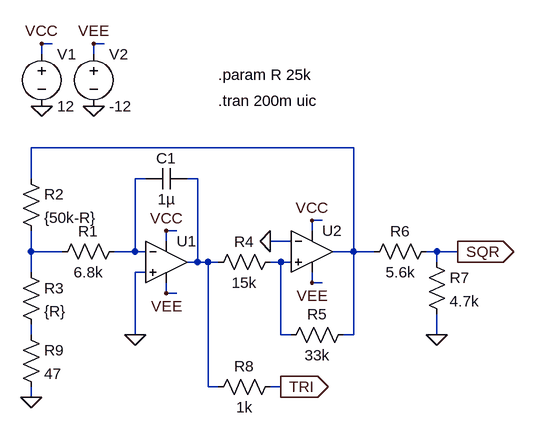
[diagram p0: schematic SimpleLFO.asc]
SimpleLFO.asc, the LTspice schematic file:
Version 4
SHEET 1 880 680
WIRE -48 -176 -64 -176
WIRE 32 -176 16 -176
WIRE -64 -160 -64 -176
WIRE 16 -160 16 -176
WIRE 416 -16 -80 -16
WIRE -80 32 -80 -16
WIRE 96 32 80 32
WIRE 176 32 160 32
WIRE 368 96 352 96
WIRE 144 112 128 112
WIRE 352 112 352 96
WIRE 128 128 128 112
WIRE 320 128 288 128
WIRE -80 144 -80 112
WIRE -32 144 -80 144
WIRE 80 144 80 32
WIRE 80 144 48 144
WIRE 96 144 80 144
WIRE 416 144 416 -16
WIRE 416 144 384 144
WIRE 448 144 416 144
WIRE 544 144 528 144
WIRE 576 144 544 144
WIRE 176 160 176 32
WIRE 176 160 160 160
WIRE 192 160 176 160
WIRE 208 160 192 160
WIRE 304 160 288 160
WIRE 320 160 304 160
WIRE 544 160 544 144
WIRE -80 176 -80 144
WIRE 96 176 80 176
WIRE 352 192 352 176
WIRE 368 192 352 192
WIRE 128 208 128 192
WIRE 144 208 128 208
WIRE -80 272 -80 256
WIRE 80 272 80 176
WIRE 304 272 304 160
WIRE 320 272 304 272
WIRE 416 272 416 144
WIRE 416 272 400 272
WIRE 544 272 544 240
WIRE 192 352 192 160
WIRE 208 352 192 352
WIRE 304 352 288 352
WIRE -80 368 -80 352
FLAG 128 112 VCC
FLAG 128 208 VEE
FLAG 352 96 VCC
FLAG 352 192 VEE
FLAG 288 128 0
FLAG 80 272 0
FLAG 544 272 0
FLAG 304 352 TRI
IOPIN 304 352 Out
FLAG 576 144 SQR
IOPIN 576 144 Out
FLAG -80 368 0
FLAG -64 -80 0
FLAG 16 -80 0
FLAG -64 -176 VCC
FLAG 16 -176 VEE
SYMBOL Opamps\\UniversalOpamp2 128 160 R0
SYMATTR InstName U1
SYMBOL Opamps\\UniversalOpamp2 352 144 R0
SYMATTR InstName U2
SYMBOL cap 160 16 R90
WINDOW 0 0 32 VBottom 2
WINDOW 3 32 32 VTop 2
SYMATTR InstName C1
SYMATTR Value 1µ
SYMBOL res 64 128 R90
WINDOW 0 0 56 VBottom 2
WINDOW 3 32 56 VTop 2
SYMATTR InstName R1
SYMATTR Value 6.8k
SYMBOL res -96 16 R0
SYMATTR InstName R2
SYMATTR Value {50k-R}
SYMBOL res -96 160 R0
SYMATTR InstName R3
SYMATTR Value {R}
SYMBOL res 304 144 R90
WINDOW 0 0 56 VBottom 2
WINDOW 3 32 56 VTop 2
SYMATTR InstName R4
SYMATTR Value 15k
SYMBOL res 416 256 R90
WINDOW 0 0 56 VBottom 2
WINDOW 3 32 56 VTop 2
SYMATTR InstName R5
SYMATTR Value 33k
SYMBOL res 544 128 R90
WINDOW 0 0 56 VBottom 2
WINDOW 3 32 56 VTop 2
SYMATTR InstName R6
SYMATTR Value 5.6k
SYMBOL res 528 144 R0
SYMATTR InstName R7
SYMATTR Value 4.7k
SYMBOL res 304 336 R90
WINDOW 0 0 56 VBottom 2
WINDOW 3 32 56 VTop 2
SYMATTR InstName R8
SYMATTR Value 1k
SYMBOL voltage -64 -176 R0
WINDOW 123 0 0 Left 0
WINDOW 39 0 0 Left 0
SYMATTR InstName V1
SYMATTR Value 12
SYMBOL voltage 16 -176 R0
WINDOW 123 0 0 Left 0
WINDOW 39 0 0 Left 0
SYMATTR InstName V2
SYMATTR Value -12
SYMBOL res -96 256 R0
SYMATTR InstName R9
SYMATTR Value 47
TEXT 208 -128 Left 2 !.param R 25k
TEXT 208 -88 Left 2 !.tran 200m uic

The netlist it stands for:
* SimpleLFO.asc
XU1 0 N002 VCC VEE N003 level.2 Avol=1Meg GBW=10Meg Slew=10Meg ilimit=25m rail=0 Vos=0 phimargin=45 en=0 enk=0 in=0 ink=0 Rin=500Meg  ; pins IN+ IN- V+ V- OUT
XU2 N005 0 VCC VEE N001 level.2 Avol=1Meg GBW=10Meg Slew=10Meg ilimit=25m rail=0 Vos=0 phimargin=45 en=0 enk=0 in=0 ink=0 Rin=500Meg  ; pins IN+ IN- V+ V- OUT
C1 N003 N002 1µ
R1 N002 N004 6.8k
R2 N001 N004 {50k-R}
R3 N004 N006 {R}
R4 N005 N003 15k
R5 N001 N005 33k
R6 SQR N001 5.6k
R7 SQR 0 4.7k
R8 TRI N003 1k
V1 VCC 0 12
V2 VEE 0 -12
R9 N006 0 47
.param R 25k
.tran 200m uic
.lib UniversalOpamps2.sub
.backanno
.end